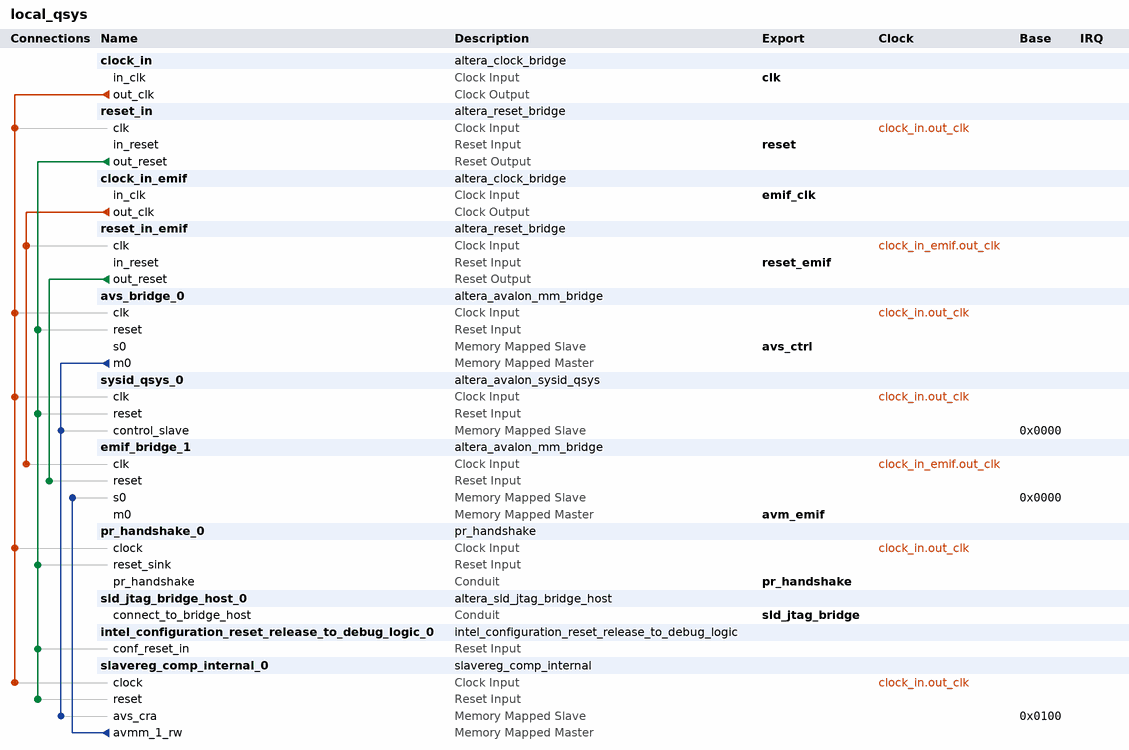
[diagram p0: system contents]
# Platform Designer (Qsys) system local_qsys, Arria 10 10AX115S2F45I1SG
# Parameters at their usual value, and those the tool derives, are not listed.
package require -exact qsys 1.0
create_system local_qsys
set_project_property DEVICE_FAMILY {Arria 10}
set_project_property DEVICE 10AX115S2F45I1SG

add_component clock_in ip/local_qsys/local_qsys_clock_in.ip altera_clock_bridge clock_in 19.2.0

add_component reset_in ip/local_qsys/local_qsys_reset_in.ip altera_reset_bridge reset_in 19.2.0

add_component clock_in_emif ip/local_qsys/local_qsys_clock_bridge_1.ip altera_clock_bridge clock_in_emif 19.2.0
load_component clock_in_emif
set_component_parameter_value DERIVED_CLOCK_RATE 266666750
set_component_parameter_value EXPLICIT_CLOCK_RATE 0
save_component

add_component reset_in_emif ip/local_qsys/local_qsys_reset_bridge_1.ip altera_reset_bridge reset_in_emif 19.2.0

add_component avs_bridge_0 ip/local_qsys/local_qsys_mm_bridge_0.ip altera_avalon_mm_bridge avs_bridge_0 20.0.1

add_component sysid_qsys_0 ip/local_qsys/local_qsys_sysid_qsys_0.ip altera_avalon_sysid_qsys sysid_qsys_0 19.1.1

add_component emif_bridge_1 ip/local_qsys/local_qsys_mm_bridge_1.ip altera_avalon_mm_bridge emif_bridge_1 20.0.1

add_component pr_handshake_0 ip/local_qsys/local_qsys_pr_handshake_0.ip pr_handshake pr_handshake_0 1.0

add_component sld_jtag_bridge_host_0 ip/local_qsys/local_qsys_sld_jtag_bridge_host_0.ip altera_sld_jtag_bridge_host sld_jtag_bridge_host_0 19.2.0

add_component intel_configuration_reset_release_to_debug_logic_0 ip/local_qsys/local_qsys_intel_configuration_reset_release_to_debug_logic_0.ip intel_configuration_reset_release_to_debug_logic intel_configuration_reset_release_to_debug_logic_0 20.3

add_component slavereg_comp_internal_0 ip/local_qsys/local_qsys_slavereg_comp_internal_0.ip slavereg_comp_internal slavereg_comp_internal_0 1.0

# connections
add_connection clock_in.out_clk avs_bridge_0.clk clock
add_connection clock_in.out_clk pr_handshake_0.clock clock
add_connection clock_in.out_clk reset_in.clk clock
add_connection clock_in.out_clk slavereg_comp_internal_0.clock clock
add_connection clock_in.out_clk sysid_qsys_0.clk clock
add_connection clock_in_emif.out_clk emif_bridge_1.clk clock
add_connection clock_in_emif.out_clk reset_in_emif.clk clock
add_connection reset_in.out_reset avs_bridge_0.reset reset
add_connection reset_in.out_reset intel_configuration_reset_release_to_debug_logic_0.conf_reset_in reset
add_connection reset_in.out_reset pr_handshake_0.reset_sink reset
add_connection reset_in.out_reset slavereg_comp_internal_0.reset reset
add_connection reset_in.out_reset sysid_qsys_0.reset reset
add_connection reset_in_emif.out_reset emif_bridge_1.reset reset
add_connection avs_bridge_0.m0 slavereg_comp_internal_0.avs_cra avalon
set_connection_parameter_value avs_bridge_0.m0/slavereg_comp_internal_0.avs_cra baseAddress 0x0100
add_connection avs_bridge_0.m0 sysid_qsys_0.control_slave avalon
set_connection_parameter_value avs_bridge_0.m0/sysid_qsys_0.control_slave baseAddress 0x0000
add_connection slavereg_comp_internal_0.avmm_1_rw emif_bridge_1.s0 avalon
set_connection_parameter_value slavereg_comp_internal_0.avmm_1_rw/emif_bridge_1.s0 baseAddress 0x0000

# exported interfaces
add_interface avm_emif avalon master
set_interface_property avm_emif EXPORT_OF emif_bridge_1.m0
add_interface avs_ctrl avalon slave
set_interface_property avs_ctrl EXPORT_OF avs_bridge_0.s0
add_interface clk clock sink
set_interface_property clk EXPORT_OF clock_in.in_clk
add_interface emif_clk clock sink
set_interface_property emif_clk EXPORT_OF clock_in_emif.in_clk
add_interface pr_handshake conduit end
set_interface_property pr_handshake EXPORT_OF pr_handshake_0.pr_handshake
add_interface reset reset sink
set_interface_property reset EXPORT_OF reset_in.in_reset
add_interface reset_emif reset sink
set_interface_property reset_emif EXPORT_OF reset_in_emif.in_reset
add_interface sld_jtag_bridge conduit end
set_interface_property sld_jtag_bridge EXPORT_OF sld_jtag_bridge_host_0.connect_to_bridge_host

save_system local_qsys.qsys
